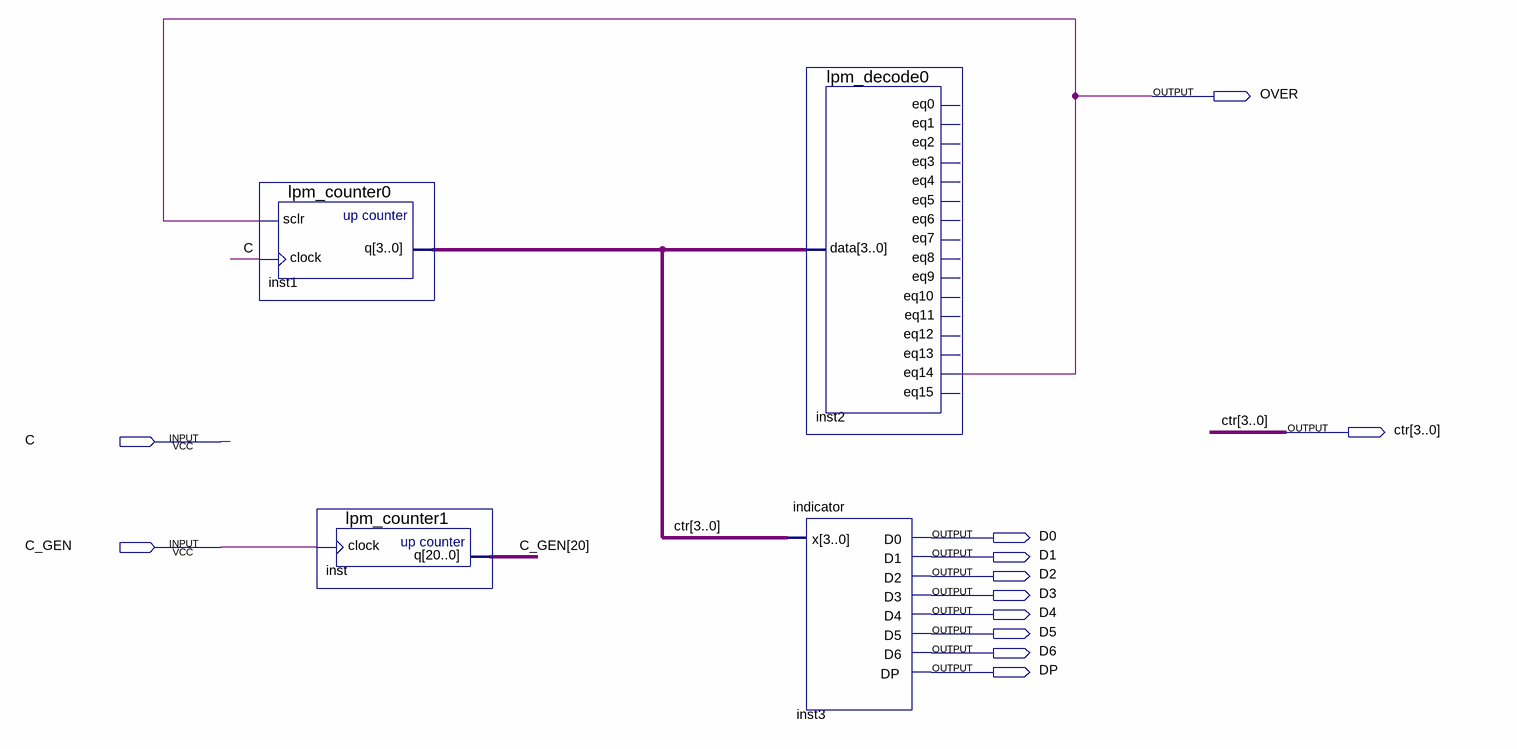
[diagram p0: schematic sheet]
// Quartus schematic Lab_7_p1.bdf as structural Verilog: 4 symbols, 12 pins
module Lab_7_p1 (
  input  C,
  input  C_GEN,
  output OVER,
  output [3:0] ctr,
  output D0,
  output D1,
  output D2,
  output D3,
  output D4,
  output D5,
  output D6,
  output DP
);

  wire [20:20] C_GEN_bus;

  lpm_counter0 inst1 (.sclr(OVER), .clock(C), .q(ctr));
  lpm_counter1 inst (.clock(C_GEN), .q(C_GEN_bus[20]));
  indicator inst3 (.x(ctr), .D0(D0), .D1(D1), .D2(D2), .D3(D3), .D4(D4), .D5(D5), .D6(D6), .DP(DP));
  lpm_decode0 inst2 (
    .data(ctr), .eq14(OVER));  // open: eq0, eq1, eq2, eq3, eq4, eq5, eq6, eq7, eq8, eq9, eq10, eq11, eq12, eq13, eq15
endmodule
